# Altium schematic sheet Sheet3.SchDoc
size A3
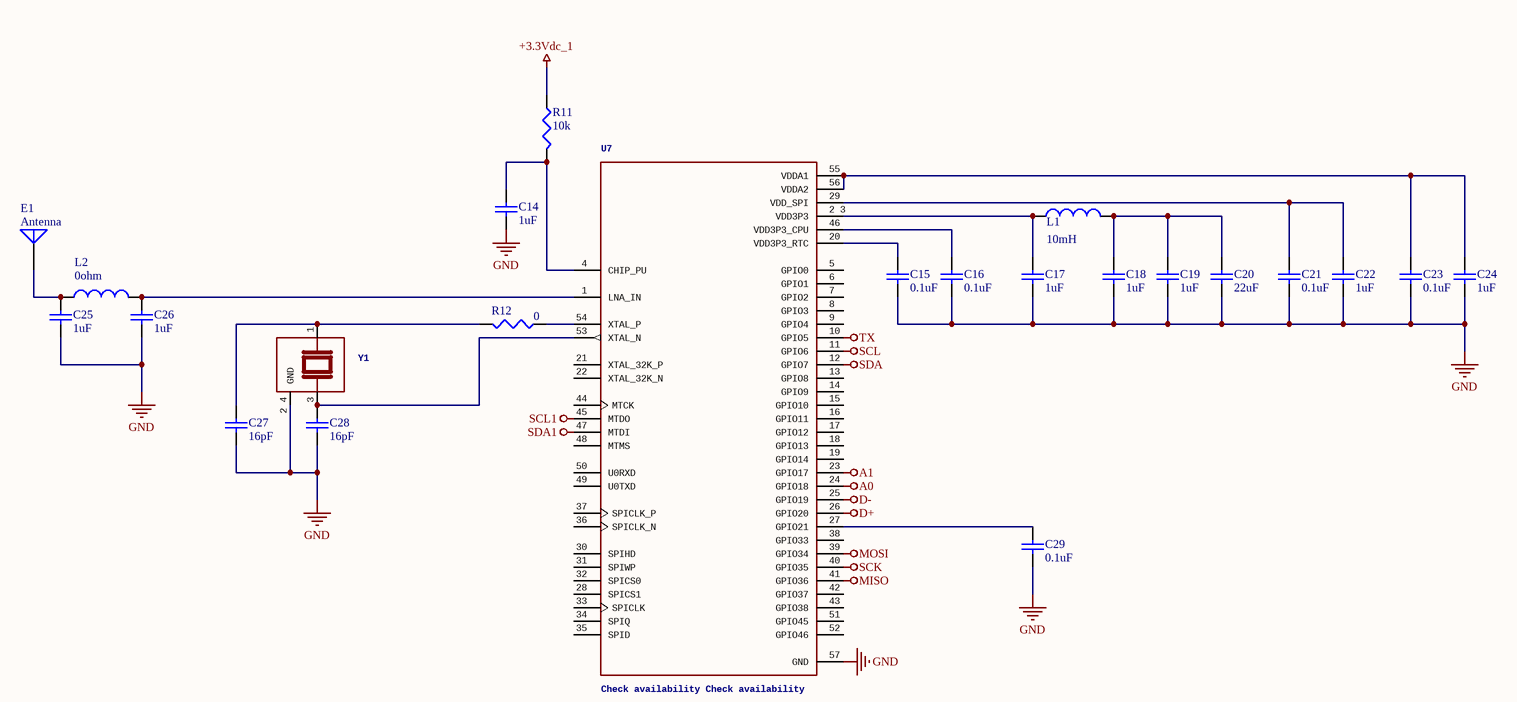
[diagram p0: Sheet3.SchDoc]

## Parts
C14  value 1uF  [0402]  (hidden comment: Cap Semi)
C15  value 0.1uF  [1608[0603]]  (hidden comment: Cap Semi)
C16  value 0.1uF  [1608[0603]]  (hidden comment: Cap Semi)
C17  value 1uF  [1608[0603]]  (hidden comment: Cap Semi)
C18  value 1uF  [1608[0603]]  (hidden comment: Cap Semi)
C19  value 1uF  [1608[0603]]  (hidden comment: Cap Semi)
C20  value 22uF  [1608[0603]]  (hidden comment: Cap Semi)
C21  value 0.1uF  [1608[0603]]  (hidden comment: Cap Semi)
C22  value 1uF  [1608[0603]]  (hidden comment: Cap Semi)
C23  value 0.1uF  [1608[0603]]  (hidden comment: Cap Semi)
C24  value 1uF  [1608[0603]]  (hidden comment: Cap Semi)
C25  value 1uF  [0402]  (hidden comment: Cap Semi)
C26  value 1uF  [0402]  (hidden comment: Cap Semi)
C27  value 16pF  [0402]  (hidden comment: Cap Semi)
C28  value 16pF  [0402]  (hidden comment: Cap Semi)
C29  value 0.1uF  [1608[0603]]  (hidden comment: Cap Semi)
E1  Antenna  [PIN1]
L1  value 10mH  [0402-A]  (hidden comment: Inductor)
L2  value 0ohm  [0402-A]  (hidden comment: Inductor)
R11  value 10k  [0402]  (hidden comment: Res3)
R12  value 0  [0402]  (hidden comment: Res3)
U7  Check availability Check availability  [QFN40P700X700X90-57N]
Y1  Check availability  [XTAL_ABM8-40.000MHZ-10-1-U-T]  (value not drawn)

## Nets
+3.3Vdc_1: R11.1
A0: U7.24(GPIO18)
A1: U7.23(GPIO17)
D+: U7.26(GPIO20)
D-: U7.25(GPIO19)
GND: C14.1 C15.2 C16.2 C17.2 C18.2 C19.2 C20.2 C21.2 C22.2 C23.2 C24.2 C25.2 C26.2 C27.1 C28.1 C29.2 U7.57(GND) Y1.2_4(GND)
MISO: U7.41(GPIO36)
MOSI: U7.39(GPIO34)
SCK: U7.40(GPIO35)
SCL: U7.11(GPIO6)
SCL1: U7.45(MTDO)
SDA: U7.12(GPIO7)
SDA1: U7.47(MTDI)
TX: U7.10(GPIO5)
NetC14_2: C14.2 R11.2 U7.4(CHIP_PU)
NetC15_1: C15.1 U7.20(VDD3P3_RTC)
NetC16_1: C16.1 U7.46(VDD3P3_CPU)
NetC17_1: C17.1 L1.1 U7.2_3(VDD3P3)
NetC18_1: C18.1 C19.1 C20.1 L1.2
NetC21_1: C21.1 C22.1 U7.29(VDD_SPI)
NetC23_1: C23.1 C24.1 U7.55(VDDA1) U7.56(VDDA2)
NetC25_1: C25.1 E1.1(A) L2.1
NetC26_1: C26.1 L2.2 U7.1(LNA_IN)
NetC27_2: C27.2 R12.2 Y1.1
NetC28_2: C28.2 U7.53(XTAL_N) Y1.3
NetC29_1: C29.1 U7.27(GPIO21)
NetR12_1: R12.1 U7.54(XTAL_P)

Not connected (* = marked no-connect by the designer): U7 5(GPIO0) 6(GPIO1) 7(GPIO2) 8(GPIO3) 9(GPIO4) 13(GPIO8) 14(GPIO9) 15(GPIO10) 16(GPIO11) 17(GPIO12) 18(GPIO13) 19(GPIO14) 21(XTAL_32K_P) 22(XTAL_32K_N) 28(SPICS1) 30(SPIHD) 31(SPIWP) 32(SPICS0) 33(SPICLK) 34(SPIQ) 35(SPID) 36(SPICLK_N) 37(SPICLK_P) 38(GPIO33) 42(GPIO37) 43(GPIO38) 44(MTCK) 48(MTMS) 49(U0TXD) 50(U0RXD) 51(GPIO45) 52(GPIO46)

## Notes on the sheet
- Title
- Size:
- Date:
- A3
- Number:
- Time:
- Revision:
- Sheet
- of
- File:

## Library data of the parts
C14-C29 = Cap Semi: Capacitor (Semiconductor SIM Model); Published: 8-Jun-2000; LatestRevisionDate: 29-May-2009; LatestRevisionNote: IPC-7351 Footprint Added.; PackageReference: C1206; Publisher: Altium Limited; PackageDescription: Chip Capacitor
E1 = Antenna: Generic Antenna; Published: 24-Mar-1999; LatestRevisionDate: 17-Jul-2002; LatestRevisionNote: Re-released for DXP Platform.; PackageReference: PIN1; Publisher: Altium Limited
L1 L2 = Inductor: Code_IEC: 1005; Published: 8-Jun-2000; LatestRevisionDate: 29-May-2009; LatestRevisionNote: IPC-7351 Footprint Added.; PackageReference: 0402-A; Publisher: Altium Limited; PackageDescription: Chip Inductor; Code_JEITA: 0402
R11 R12 = Res3: Resistor; Published: 8-Jun-2000; LatestRevisionDate: 29-May-2009; LatestRevisionNote: IPC-7351 Footprint Added.; PackageReference: J1-0603; Publisher: Altium Limited; PackageDescription: Chip Resistor
U7 = ESP32-S3R2: GateName_1: G$1; MF: Espressif Systems; SymbolName_1: ESP32-S3R2; LibraryName: ESP32-S3R2; DeviceSetName: ESP32-S3R2; Digi-Key_Part_Number: 1904-ESP32-S3R2-ND; Purchase-URL: https://pricing.snapeda.com/search/part/ESP32-S3R2/?ref=eda; Package: None; MP: ESP32-S3R2
Y1 = ABM8-40.000MHZ-10-1-U-T: GateName_1: G$1; MF: Abracon; SymbolName_1: ABM8-40.000MHZ-10-1-U-T; LibraryName: ABM8-40.000MHZ-10-1-U-T; DeviceSetName: ABM8-40.000MHZ-10-1-U-T; Price: None; Availability: In Stock; Purchase-URL: https://pricing.snapeda.com/search/part/ABM8-40.000MHZ-10-1-U-T/?ref=eda; Package: SMD-4 Abracon; MP: ABM8-40.000MHZ-10-1-U-T